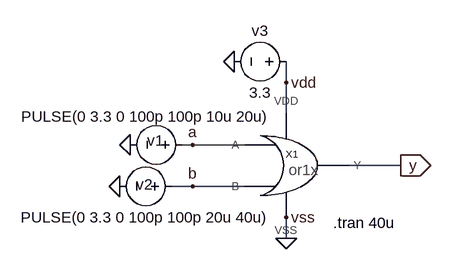
[diagram p0: schematic or1x_tb_tran.asc]
or1x_tb_tran.asc, the LTspice schematic file:
Version 4.1
SHEET 1 880 680
WIRE 192 96 192 64
WIRE 192 144 192 96
WIRE 48 192 32 192
WIRE 128 192 48 192
WIRE 368 224 288 224
WIRE 48 256 16 256
WIRE 128 256 48 256
WIRE 192 336 192 304
FLAG 112 64 0
FLAG -48 192 0
FLAG -64 256 0
FLAG 368 224 y
IOPIN 368 224 Out
FLAG 192 336 0
FLAG 48 192 a
FLAG 48 256 b
FLAG 192 96 vdd
FLAG 192 304 vss
SYMBOL voltage 48 192 R90
WINDOW 0 9 57 VBottom 2
WINDOW 3 -59 71 VTop 2
WINDOW 123 0 0 Left 0
WINDOW 39 -52 171 VTop 2
SYMATTR InstName v1
SYMATTR Value PULSE(0 3.3 0 100p 100p 10u 20u)
SYMBOL voltage 32 256 R90
WINDOW 0 13 58 VBottom 2
WINDOW 3 32 56 VTop 2
WINDOW 123 0 0 Left 0
WINDOW 39 60 56 VTop 2
SYMATTR InstName v2
SYMATTR Value PULSE(0 3.3 0 100p 100p 20u 40u)
SYMBOL voltage 208 64 R90
WINDOW 0 -32 56 VBottom 2
WINDOW 3 32 56 VTop 2
WINDOW 123 0 0 Left 0
WINDOW 39 0 0 Left 0
SYMATTR InstName v3
SYMATTR Value 3.3
SYMBOL diglib\\or\\or1x 192 224 R0
SYMATTR InstName X1
TEXT 264 312 Left 2 !.tran 40u

The netlist it stands for:
* or1x_tb_tran.asc
v1 a 0 PULSE(0 3.3 0 100p 100p 10u 20u)
v2 b 0 PULSE(0 3.3 0 100p 100p 20u 40u)
v3 vdd 0 3.3
X§X1 b vdd 0 y a or1x  ; pins B VDD VSS Y A
.tran 40u
.backanno
.end